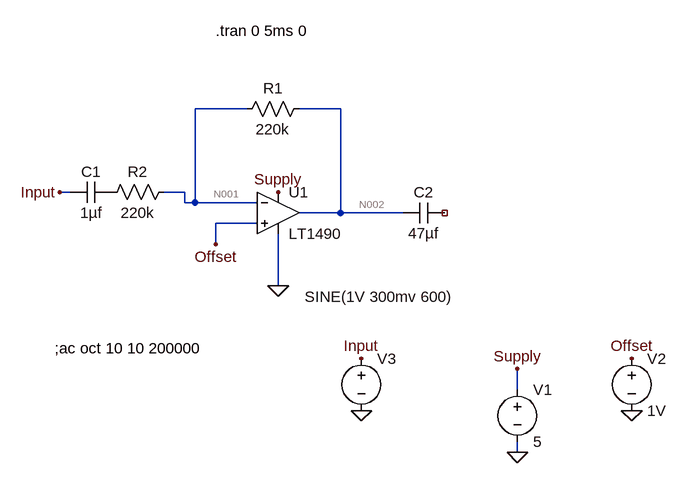
[diagram p0: schematic Draft12.asc]
Draft12.asc, the LTspice schematic file:
Version 4
SHEET 1 880 680
WIRE -48 -240 -128 -240
WIRE 96 -240 32 -240
WIRE -320 -112 -336 -112
WIRE -144 -112 -176 -112
WIRE -144 -96 -144 -112
WIRE -128 -96 -128 -240
WIRE -128 -96 -144 -96
WIRE -32 -96 -128 -96
WIRE 96 -80 96 -240
WIRE 96 -80 32 -80
WIRE 192 -80 96 -80
WIRE -32 -64 -96 -64
WIRE -96 -32 -96 -64
WIRE 0 32 0 -48
WIRE 368 192 368 160
WIRE 368 288 368 272
FLAG 368 288 0
FLAG 0 -112 Supply
FLAG 368 160 Supply
FLAG 128 144 Input
FLAG 128 224 0
FLAG 0 32 0
FLAG -336 -112 Input
FLAG 544 224 0
FLAG 544 144 Offset
FLAG -96 -32 Offset
SYMBOL voltage 368 176 R0
WINDOW 123 0 0 Left 2
WINDOW 39 0 0 Left 2
SYMATTR InstName V1
SYMATTR Value 5
SYMBOL voltage 128 128 R0
WINDOW 3 -87 -79 Left 2
WINDOW 123 31 -30 Left 2
WINDOW 39 0 0 Left 2
SYMATTR Value SINE(1V 300mv 600)
SYMATTR InstName V3
SYMBOL res -64 -224 R270
WINDOW 0 32 56 VTop 2
WINDOW 3 0 56 VBottom 2
SYMATTR InstName R1
SYMATTR Value 220k
SYMBOL res -272 -96 R270
WINDOW 0 32 56 VTop 2
WINDOW 3 0 56 VBottom 2
SYMATTR InstName R2
SYMATTR Value 220k
SYMBOL cap -256 -128 R90
WINDOW 0 0 32 VBottom 2
WINDOW 3 32 32 VTop 2
SYMATTR InstName C1
SYMATTR Value 1µf
SYMBOL Opamps\\LT1490 0 -144 R0
SYMATTR InstName U1
SYMBOL voltage 544 128 R0
WINDOW 123 0 0 Left 2
WINDOW 39 0 0 Left 2
SYMATTR InstName V2
SYMATTR Value 1V
SYMBOL cap 256 -96 R90
WINDOW 0 0 32 VBottom 2
WINDOW 3 32 32 VTop 2
SYMATTR InstName C2
SYMATTR Value 47µf
TEXT -96 -360 Left 2 !.tran 0 5ms 0
TEXT -344 128 Left 2 !;ac oct 10 10 200000

The netlist it stands for:
* Draft12.asc
V1 Supply 0 5
V3 Input 0 SINE(1V 300mv 600)
R1 N001 N002 220k
R2 P001 N001 220k
C1 P001 Input 1µf
XU1 Offset N001 Supply 0 N002 LT1490  ; pins In+ In- V+ V- OUT
V2 Offset 0 1V
C2 NC_01 N002 47µf
.tran 0 5ms 0
;ac oct 10 10 200000
.backanno
.end

* Results of the author's LTspice run, read from the files saved beside the schematic
* Operating Point, zero values left out:
*   V(supply) = 5 V
*   V(input) = 1 V
*   V(n001) = 1 V
*   V(n002) = 999.6 mV
*   V(p001) = 1 V
*   V(offset) = 1 V
*   I(R1) = 1.648 nA
*   I(V2) = 1.648 nA
*   I(V1) = -57.8 µA
*   Ix(u1:1) = -1.648 nA
*   Ix(u1:2) = -1.648 nA
*   Ix(u1:3) = 57.8 µA
*   Ix(u1:4) = -57.79 µA
*   Ix(u1:5) = 1.651 nA
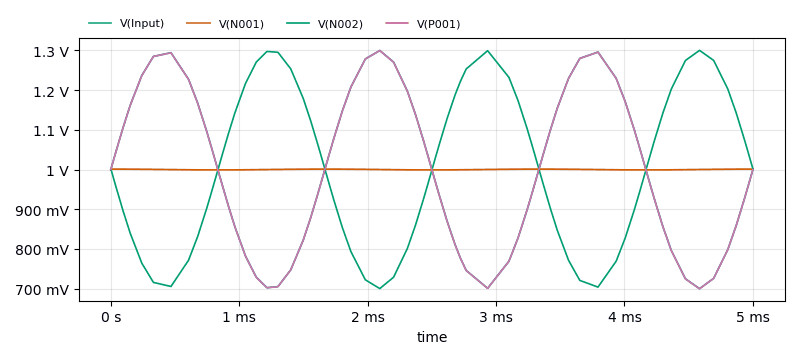
[diagram p1: Transient Analysis of Draft12.asc, plotted from the saved traces]
* Transient Analysis, 1 run:
*   V(Input): min 700 mV, max 1.3 V, average 1 V, rms 1.022 V, last 1 V
*   V(N001): min 999 mV, max 1.001 V, average 1 V, rms 1 V, last 1.001 V
*   V(N002): min 700.2 mV, max 1.3 V, average 1 V, rms 1.022 V, last 1.002 V
*   V(P001): min 699.7 mV, max 1.299 V, average 999.6 mV, rms 1.021 V, last 1 V